# Altium schematic sheet Peripherals.SchDoc
size B; SheetNumber: 2; SheetTotal: 2; ENG_APP_DATE: --/--/--; DSN_APP_DATE: --/--/--; CHK_APP_DATE: --/--/--
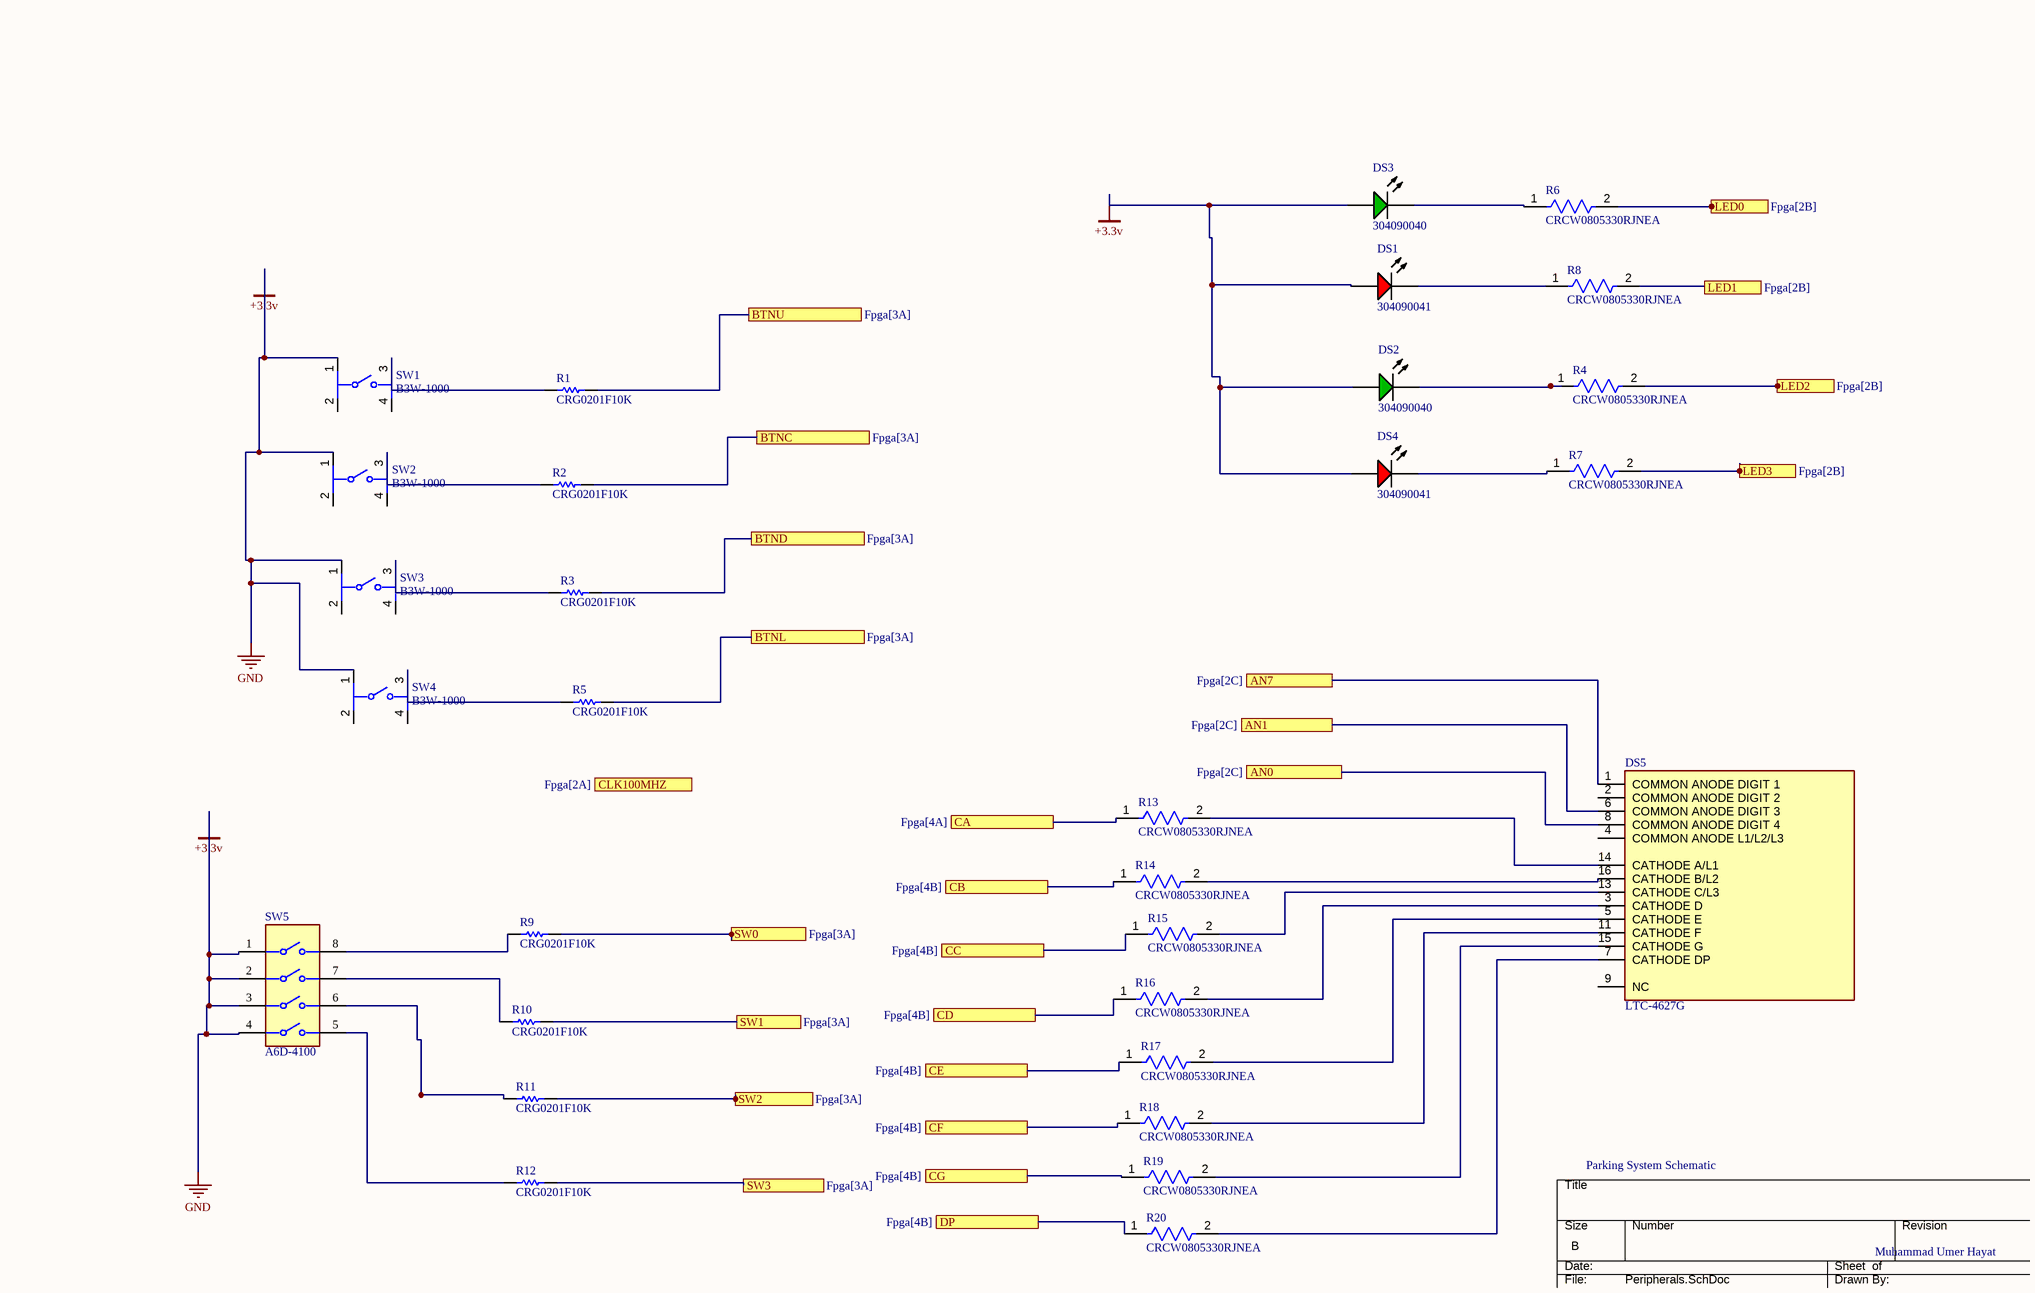
[diagram p0: Peripherals.SchDoc]

## Parts
DS1  304090041  [LED-2P-2.28-3MM_A]
DS2  304090040  [LED-2P-2.28-3MM]
DS3  304090040  [LED-2P-2.28-3MM]
DS4  304090041  [LED-2P-2.28-3MM_A]
DS5  LTC-4627G  [FP-LTC-4627G-MFG]
R1  CRG0201F10K  [RESC0603X26X15LL03T05]
R2  CRG0201F10K  [RESC0603X26X15LL03T05]
R3  CRG0201F10K  [RESC0603X26X15LL03T05]
R4  CRCW0805330RJNEA  [FP-CRCW0805-e3-IPC_C]
R5  CRG0201F10K  [RESC0603X26X15LL03T05]
R6  CRCW0805330RJNEA  [FP-CRCW0805-e3-IPC_C]
R7  CRCW0805330RJNEA  [FP-CRCW0805-e3-IPC_C]
R8  CRCW0805330RJNEA  [FP-CRCW0805-e3-IPC_C]
R9  CRG0201F10K  [RESC0603X26X15LL03T05]
R10  CRG0201F10K  [RESC0603X26X15LL03T05]
R11  CRG0201F10K  [RESC0603X26X15LL03T05]
R12  CRG0201F10K  [RESC0603X26X15LL03T05]
R13  CRCW0805330RJNEA  [FP-CRCW0805-e3-IPC_C]
R14  CRCW0805330RJNEA  [FP-CRCW0805-e3-IPC_C]
R15  CRCW0805330RJNEA  [FP-CRCW0805-e3-IPC_C]
R16  CRCW0805330RJNEA  [FP-CRCW0805-e3-IPC_C]
R17  CRCW0805330RJNEA  [FP-CRCW0805-e3-IPC_C]
R18  CRCW0805330RJNEA  [FP-CRCW0805-e3-IPC_C]
R19  CRCW0805330RJNEA  [FP-CRCW0805-e3-IPC_C]
R20  CRCW0805330RJNEA  [FP-CRCW0805-e3-IPC_C]
SW1  B3W-1000  [FP-B3W-1000-MFG]
SW2  B3W-1000  [FP-B3W-1000-MFG]
SW3  B3W-1000  [FP-B3W-1000-MFG]
SW4  B3W-1000  [FP-B3W-1000-MFG]
SW5  A6D-4100  [FP-A6D-4100-MFG]

## Ports
AN0 (see Fpga[2C]), AN1 (see Fpga[2C]), AN7 (see Fpga[2C]), BTNC (see Fpga[3A]), BTND (see Fpga[3A]), BTNL (see Fpga[3A]), BTNU (see Fpga[3A]), CA (see Fpga[4A]), CB (see Fpga[4B]), CC (see Fpga[4B]), CD (see Fpga[4B]), CE (see Fpga[4B]), CF (see Fpga[4B]), CG (see Fpga[4B]), CLK100MHZ (see Fpga[2A]), DP (see Fpga[4B]), LED0 (see Fpga[2B]), LED1 (see Fpga[2B]), LED2 (see Fpga[2B]), LED3 (see Fpga[2B]), SW0 (see Fpga[3A]), SW1 (see Fpga[3A]), SW2 (see Fpga[3A]), SW3 (see Fpga[3A])

## Nets
+3.3v: DS1.1(A) DS2.1(A) DS3.1(A) DS4.1(A) SW1.1 SW2.1 SW3.1 SW4.1 SW5.1 SW5.2 SW5.3 SW5.4  [also labelled GND]
AN0: DS5.8(COMMON_ANODE_DIGIT_4) ; port AN0
AN1: DS5.6(COMMON_ANODE_DIGIT_3) ; port AN1
AN7: DS5.1(COMMON_ANODE_DIGIT_1) ; port AN7
BTNC: R2.2 ; port BTNC
BTND: R3.2 ; port BTND
BTNL: R5.2 ; port BTNL
BTNU: R1.2 ; port BTNU
CA: R13.1 ; port CA
CB: R14.1 ; port CB
CC: R15.1 ; port CC
CD: R16.1 ; port CD
CE: R17.1 ; port CE
CF: R18.1 ; port CF
CG: R19.1 ; port CG
DP: R20.1 ; port DP
LED0: R6.2 ; port LED0
LED1: R8.2 ; port LED1
LED2: R4.2 ; port LED2
LED3: R7.2 ; port LED3
SW0: R9.2 ; port SW0
SW1: R10.2 ; port SW1
SW2: R11.2 ; port SW2
SW3: R12.2 ; port SW3
NetDS1_2: DS1.2(K) R8.1
NetDS2_2: DS2.2(K) R4.1
NetDS3_2: DS3.2(K) R6.1
NetDS4_2: DS4.2(K) R7.1
NetDS5_3: DS5.3(CATHODE_D) R16.2
NetDS5_5: DS5.5(CATHODE_E) R17.2
NetDS5_7: DS5.7(CATHODE_DP) R20.2
NetDS5_11: DS5.11(CATHODE_F) R18.2
NetDS5_13: DS5.13(CATHODE_C/L3) R15.2
NetDS5_14: DS5.14(CATHODE_A/L1) R13.2
NetDS5_15: DS5.15(CATHODE_G) R19.2
NetDS5_16: DS5.16(CATHODE_B/L2) R14.2
NetR1_1: R1.1 SW1.3
NetR2_1: R2.1 SW2.3
NetR3_1: R3.1 SW3.3
NetR5_1: R5.1 SW4.3
NetR9_1: R9.1 SW5.8
NetR10_1: R10.1 SW5.7
NetR11_1: R11.1 SW5.6
NetR12_1: R12.1 SW5.5

Not connected (* = marked no-connect by the designer): DS5 2(COMMON_ANODE_DIGIT_2) 4(COMMON_ANODE_L1/L2/L3) 9(NC); SW1 2 4; SW2 2 4; SW3 2 4; SW4 2 4

## Notes on the sheet
- Parking System Schematic
- Muhammad Umer Hayat
- DWG. NO.
- REV.
- SHT.
- THIS DOCUMENT AND THE DATA DISCLOSED HEREIN OR HEREWITH IS THE PROPERTY OF ALTIUM LIMITED AND MAY BE FREELY DISTRIBUTED IN WHOLE. NO RIGHTS ARE RESERVED OR EXPRESS OR IMPLIED WARANTEE GIVEN.
- REVISION
- DESCRIPTION
- DATE
- APPROVED
- ENG:
- APPROVALS
- PROJECT
- DSN:
- CHK:
- REFERENCE DOCUMENTS
- PROJECT REVISION:
- TITLE
- DOCUMENT REVISION:
- DESIGN ITEM:
- BOM:
- FAB DWG:
- PCB DWG:
- ASSY DWG:
- SCALE:
- SIZE
- B
- CAGE CODE
- FILE NAME
- DWG NO.
- SHEET
- OF
- REV

## Library data of the parts
DS1 DS4 = CMP-007-00007-2: Red LED, 80 mW, 30 mA, -25 to 85 degC, 2-Pin THD; Manufacturer: Shenzhen CGX; Package Description: 2-Pin Through Hole Device, Dia 3 mm, Pitch 2.28 mm; Datasheet URL: http://datasheet.octopart.com/304090041-Chengguangxing-datasheet-62330656.pdf; Mounting Technology: TH; Manufacturer URL: http://szcgx.com/; RoHS Compliant: Unknown; Datasheet Version: Sep-14; Case/Package: 304090041; Package Reference: 304090041
DS2 DS3 = CMP-007-00006-2: Green LED, 80 mW, 20 mA, -25 to 85 degC, 2-Pin THD; Manufacturer: Shenzhen CGX; Manufacturer URL: http://szcgx.com/; Package Reference: 304090040; Datasheet Version: Rev. 1.0, 09/2014; RoHS Compliant: Unknown; Case/Package: 304090040; Package Description: 2-Pin Through Hole Device, Dia 3 mm, Pitch 2.28 mm; Datasheet URL: http://datasheet.octopart.com/304090040-Chengguangxing-datasheet-62330655.pdf; Mounting Technology: TH
DS5 = CMP-2000-06610-2: LED 7-SEG 4DIGIT GRN 0.4" CA; Manufacturer: Lite-On; Test Current: 20mA; Luminous Intensity: 2.2mcd; Wavelength: 569nm; Power Dissipation: 75mW; Element Config: Common Anode; Reverse Voltage: 5V; Forward Voltage: 2.1V; Temperature Range Low: -35°C; Lead Free: Yes; Manufacturer Part Number: LTC-4627G; Height: 7.25mm; Package: 0; Device Class L1: Optoelectronics; Category: Disp; Mouser Description: LED Displays & Accessories 4 Digit, Green; Display Type: LED; Forward Current: 20mA; Device Class L2: Displays; Device Class L3: LED Displays; ComponentLink2Description: Datasheet; Octopart: https://octopart.com/ltc-4627g-lite-on-8442722; ComponentLink2URL: https://datasheet.ciiva.com/15136/getdatasheetpartid-630597-15136600.pdf; Automotive: No; Temperature: -35°C to +85°C; RoHS: TRUE; Temperature Range High: +85°C; Digikey Description: LED 7-SEG 4DIGIT GRN 0.4" CA
R1-R3 R5 R9-R12 = CMP-2004-03568-1: Manufacturer: TE Connectivity / AMP; Part Number: CRG0201F10K
R4 R6-R8 R13-R20 = CMP-2001-03824-2: RES Thick Film, 330Ω, 5%, 0.125W, 200ppm/°C, 0805; Power Rating: 125mW; Voltage Rating (DC): 150V; Resistance: 330R; Case Code (Imperial): 0805; Temperature Coefficient: 200ppm/°C; Military Standard: Not; Tolerance: 5%; Max Power Dissipation: 125mW; Composition: Thick Film; Height: 0.02inch; Depth: 1.25mm; Termination: SMD/SMT; Voltage Rating: 150V; Max Operating Temperature: 155°C; Min Operating Temperature: -55°C; Number of Terminations: 2; Packaging: Tape and Reel; Radiation Hardening: No; Case/Package: 0805; Lead Free: Lead Free; Package Quantity: 1; Contact Plating: Tin; Length: 2mm; Case Code (Metric): 2012; Features: Automotive AEC-Q200; Weight: 0.000194oz; Width: 0.049inch
SW1-SW4 = CMP-08834-000045-1: SWITCH TACTILE SPST-NO 0.05A 24V; Actuator Color: White; Actuator Type: Standard; Current Rating: 50mA; Ratings: IP67; Number of Poles: 1; Illumination Type: Non-Illuminated; Actuator Length: 0.9mm; Switch Function: Off-Mom; Mechanical Life: 1000000Cycles; Throw Configuration: SPST; Operating Force: 1.57N; Contact Resistance: 100mR; Switch Travel: 0.25mm; Mount: Through Hole; Orientation: Straight; Termination: PC Pins; Series: B3W; Max Operating Temperature: 70°C; Contact Plating: Silver; Max Current Rating: 50mA; RoHS Compliant: Yes; Packaging: Bulk; Contact Material: Silver; Length: 6.6mm; Voltage Rating (DC): 24V; Min Operating Temperature: -25°C; Radiation Hardening: No; Package Quantity: 100; Depth: 6.6mm; Max Voltage Rating (DC): 24V; Weight: 0.3g; Insulation Resistance: 100MR; Contact Current Rating: 50mA
SW5 = CMP-08827-000021-1: SWITCH SLIDE DIP SPST 30MA 30V; Contact Resistance: 100mR; Actuator Type: Slide (Standard); Mechanical Life: 5000Cycles; Contact Current Rating: 100mA; Max Current Rating: 300mA; Number of Circuits: 4; Actuator Length: 0mm; Pitch: 0.1inch; Electrical Life: 2000Cycles; Washable: Yes; Min Operating Temperature: -20°C; Radiation Hardening: No; Package Quantity: 43; Voltage Rating (DC): 30V; Series: A6D; Depth: 7.62mm; RoHS Compliant: Yes; Case/Package: DIP; Contact Plating: Gold; Contact Material: Copper; Throw Configuration: SPST; Current Rating: 30mA; Orientation: Straight; Number of Positions: 4; Lead Free: Lead Free; Terminal Pitch: 2.54mm; Max Voltage Rating (DC): 30V; Length: 0.479inch; Termination: PC Pins; Insulation Resistance: 100MR; Weight: 0.015873oz; Mount: Through Hole; Max Operating Temperature: 70°C; Packaging: Rail/Tube; Number of Poles: 4